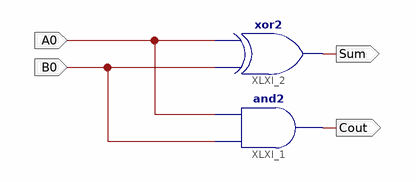
[diagram p0: schematic sheet 1]
// Xilinx ISE schematic Half_Adder_Schematic.sch (spartan3) as structural Verilog: 2 symbols, 4 ports
module Half_Adder_Schematic (
  input  A0,
  input  B0,
  output Sum,
  output Cout
);

  and XLXI_1 (Cout, B0, A0);
  xor XLXI_2 (Sum, B0, A0);
endmodule
